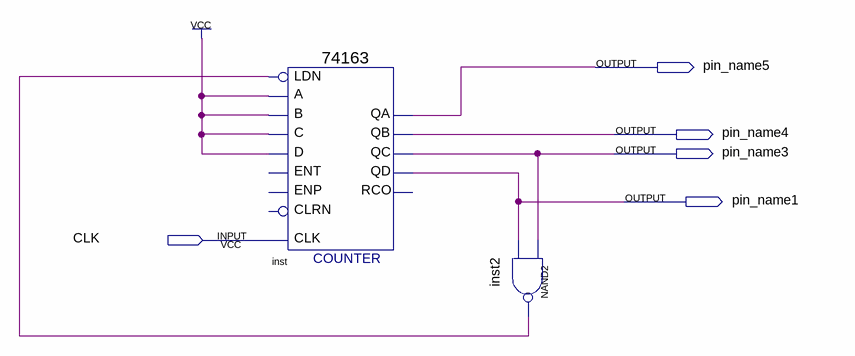
[diagram p0: schematic sheet]
// Quartus schematic SpecialCount0.bdf as structural Verilog: 2 symbols, 5 pins
module SpecialCount0 (
  input  CLK,
  output pin_name5,
  output pin_name4,
  output pin_name3,
  output pin_name1
);

  wire inst2_out;

  \74163  inst (
    .C(1'b1), .B(1'b1), .A(1'b1), .D(1'b1), .CLK(CLK), .LDN(inst2_out), .QA(pin_name5), .QB(pin_name4),
    .QC(pin_name3), .QD(pin_name1));  // open: ENT, CLRN, ENP, RCO
  nand inst2 (inst2_out, pin_name3, pin_name1);
endmodule
